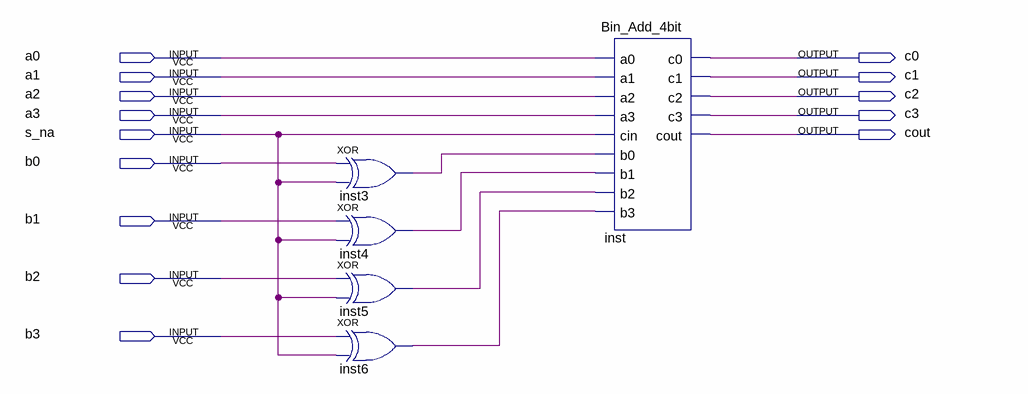
[diagram p0: schematic sheet]
// Quartus schematic BIN_Add_Sub_4bit.bdf as structural Verilog: 5 symbols, 14 pins
module BIN_Add_Sub_4bit (
  input  a0,
  input  a1,
  input  a2,
  input  a3,
  input  s_na,
  input  b0,
  input  b1,
  input  b2,
  input  b3,
  output c0,
  output c1,
  output c2,
  output c3,
  output cout
);

  wire inst3_out, inst4_out, inst5_out, inst6_out;

  xor inst3 (inst3_out, b0, s_na);
  xor inst4 (inst4_out, b1, s_na);
  xor inst5 (inst5_out, b2, s_na);
  xor inst6 (inst6_out, b3, s_na);
  Bin_Add_4bit inst (
    .a0(a0), .a1(a1), .a2(a2), .a3(a3), .cin(s_na), .b0(inst3_out), .b1(inst4_out), .b2(inst5_out),
    .b3(inst6_out), .c0(c0), .c1(c1), .c2(c2), .c3(c3), .cout(cout));
endmodule
